# Altium project LED_Board.PrjPcb
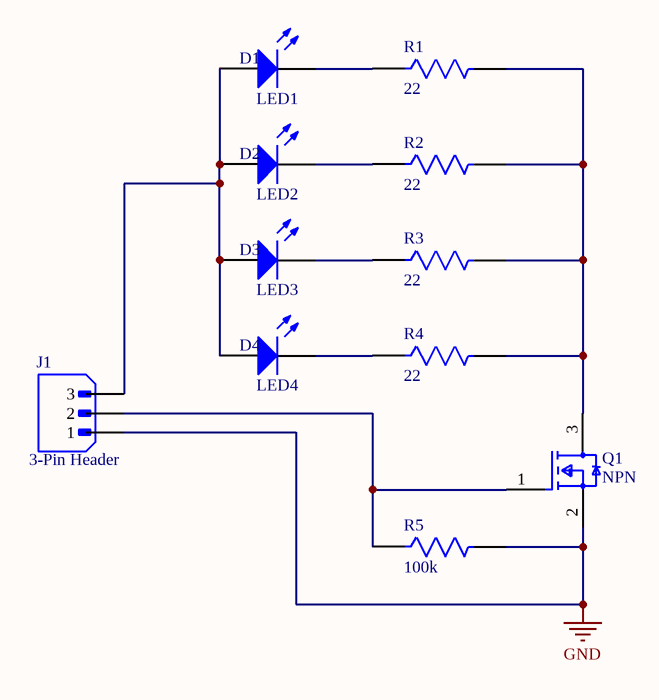
[diagram p0: Sheet1.SchDoc]
1 sheet, 11 parts. Net scope: global (net labels, ports and power ports of the same name join across sheets).
Board file: LED_Board.PcbDoc

## Sheet Sheet1.SchDoc
size A4; SheetNumber: 1; SheetTotal: 1

### Parts
D1  LED1  [LUMD-L128_V]
D2  LED2  [LUMD-L128_V]
D3  LED3  [LUMD-L128_V]
D4  LED4  [LUMD-L128_V]
J1  3-Pin Header  [JST_B3B-XH-A]
Q1  NPN  [FP-SOT23-MFG]
R1  22  [FP-SR1206-MFG]
R2  22  [FP-SR1206-MFG]
R3  22  [FP-SR1206-MFG]
R4  22  [FP-SR1206-MFG]
R5  100k  [FP-CRGP0603-IPC_C]

### Nets
GND: J1.1 Q1.2(S) R5.2
NetD1_1: D1.1(K) R1.1
NetD1_2: D1.2(A) D2.2(A) D3.2(A) D4.2(A) J1.3
NetD2_1: D2.1(K) R2.1
NetD3_1: D3.1(K) R3.1
NetD4_1: D4.1(K) R4.1
NetJ1_2: J1.2 Q1.1(G) R5.1
NetQ1_3: Q1.3(D) R1.2 R2.2 R3.2 R4.2

### Library data of the parts
D1-D4 = CMP-2100-03745-1: LUXEON 2835 Line, Voltage 9 V, Nominal CCT 2700K, Luminous Flux 75 Im, -40 to 105 degC, 2-Pin SMD, RoHS, Tape and Reel; Manufacturer: Lumileds; Min Luminous Flux: 67 Im; Min CRI: 80; Typical Luminous Efficacy: 137 Im/w; Voltage: 9 V; Test Current: 60 mA; Typical Luminous Flux: 75 Im; Datasheet URL: https://www.lumileds.com/uploads/603/DS216-pdf; Package Reference: L128; Nominal CCT: 2700K; Manufacturer URL: https://www.lumileds.com; Datasheet Version: 42979; Package Description: 2-Pin Surface Mount Device, Body 2.8 x 3.5 mm; Mounting Technology: SurfaceMount
J1 = B3B-XH-A: Connector Header Through Hole 3 position 0.098 (2.50mm); MF: JST Sales; SnapEDA_Link: https://www.snapeda.com/parts/B3B-XH-A/JST+Sales+America+Inc./view-part/?ref=snap; Package: None; Value: *; MP: B3B-XH-A; Check_prices: https://www.snapeda.com/parts/B3B-XH-A/JST+Sales+America+Inc./view-part/?ref=eda
Q1 = CMP-83955-000006-1: MOSFET N-CH 30V 5.7A SOT23; Input Capacitance: 630pF; Number of Elements: 1; Rds On Max: 26.5mR; Max Power Dissipation: 1.4W; Gate to Source Voltage (Vgs): 12V; Min Operating Temperature: -55°C; Lead Free: Lead Free; Number of Pins: 3; Drain to Source Voltage (Vdss): 30V; Case/Package: SOT-23; Mount: Surface Mount; Continuous Drain Current (ID): 5.7A; Radiation Hardening: No; Packaging: Tape and Reel; Max Operating Temperature: 150°C; Power Dissipation: 1.4W
R1-R4 = CMP-03412-023562-1: RES 22 OHM 1% 1/2W 1206; Manufacturer Part Number: SR1206FR-7W22RL; Manufacturer: Yageo; Tolerance: 0.01; Voltage Rating: 200V; Value: 22Ω; Automotive Grade: Grade 0; Power Rating: 0.5W; ComponentLink2URL: http://www.yageo.com/documents/recent/PYu-SR_D_F%20tol_RoHS_L_3.pdf; Temperature Range Low: -55°C; Temperature: -55°C to +155°C; Footprint Url: http://www.yageo.com/exep/pages/download/literatures/PYu-R_Mount_10.pdf; Ipc Land Pattern Name: RESC310160X55; Automotive: Yes; Lead Free: Yes; Device Class L2: Resistors; Resistance: 22Ω; Series: SR; Category: Res; Device Class L1: Passive Components; Octopart: https://octopart.com/sr1206fr-7w22rl-yageo-92673882; Composition: Thick Film; Device Class L3: Chip SMD Resistors; Temperature Range High: +155°C; ComponentLink2Description: Datasheet; Package: SR1206; RoHS: TRUE; Height: 0.65mm; Digikey Description: RES 22 OHM 1% 1/2W 1206
R5 = CMP-03211-000885-1: CRGP 0603 100K 1%; Manufacturer: TE; Manufacturer Part Number: CRGP0603F100K; Power Rating: 0.25W; Resistance: 100KΩ; Voltage Rating: 50V; Value: 100KΩ; Tolerance: 0.01; Temperature Coefficient: ±100ppm/°C; Device Class L2: Resistors; Temperature: -55°C to +155°C; Temperature Range High: +155°C; Ambient Temperature Range High: +70°C; Lead Free: Yes; RoHS: TRUE; Octopart: https://octopart.com/crgp0603f100k-te+connectivity-91018719; Digikey Description: CRGP 0603 100K 1%; Automotive: No; ComponentLink2Description: Datasheet; Category: Res; Ipc Land Pattern Name: RESC16080X45; Device Class L3: Chip SMD Resistors; Composition: Thick Film; Temperature Range Low: -55°C; Height: 0.55mm; Device Class L1: Passive Components; Series: CRGP; Package: CRGP0603; ComponentLink2URL: https://www.te.com/commerce/DocumentDelivery/DDEController?Action=srchrtrv&DocNm=9-1773463-9&DocType=DS&DocLang=English